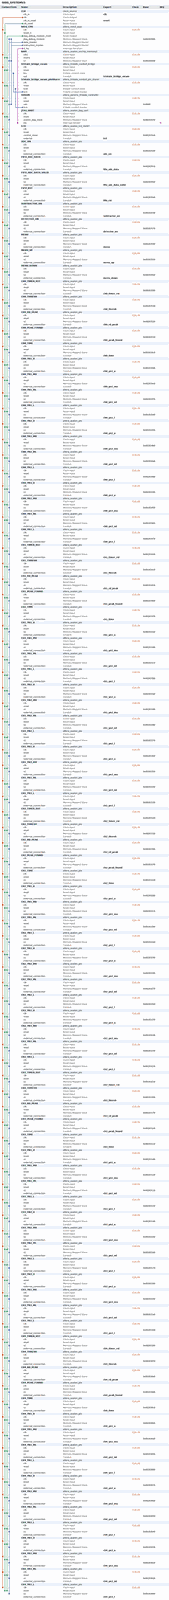
[diagram p0: system contents, whole]
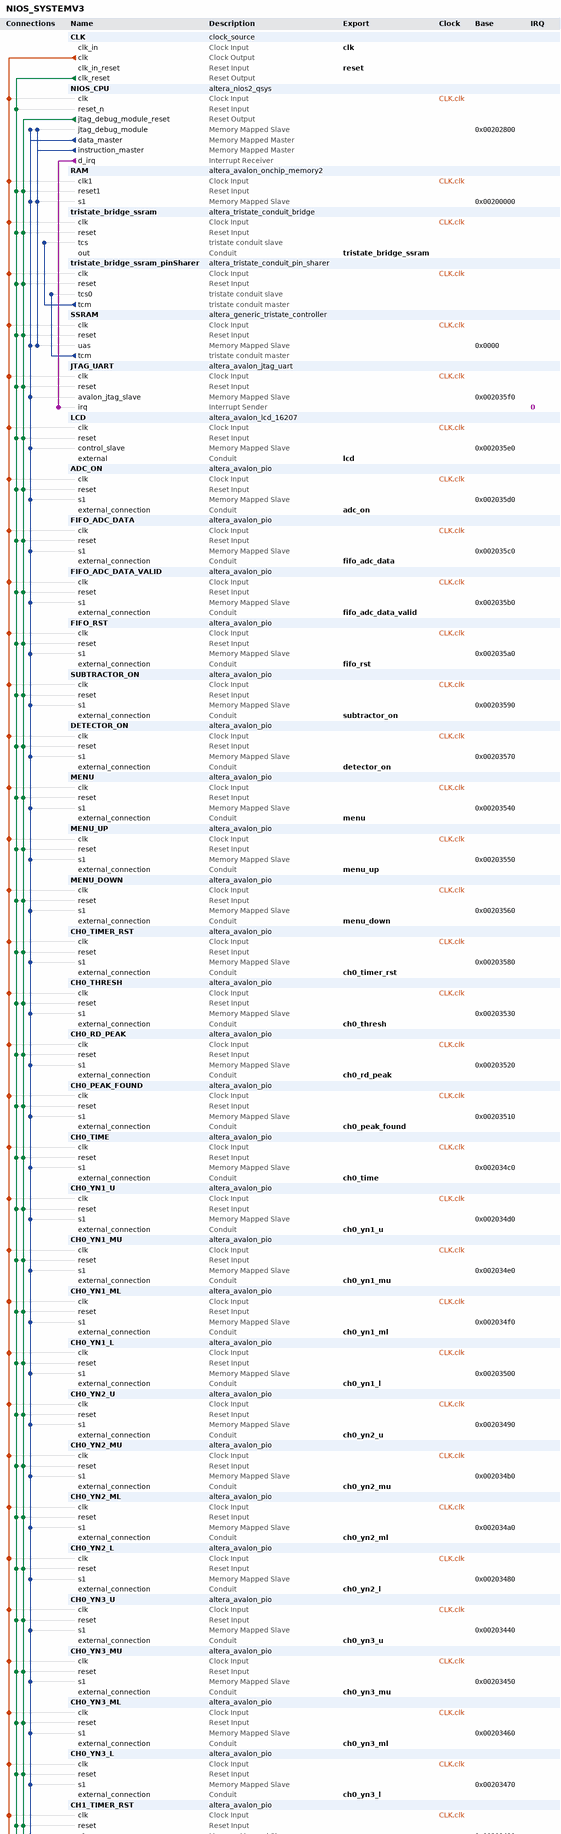
[diagram p1: system contents, upper part]
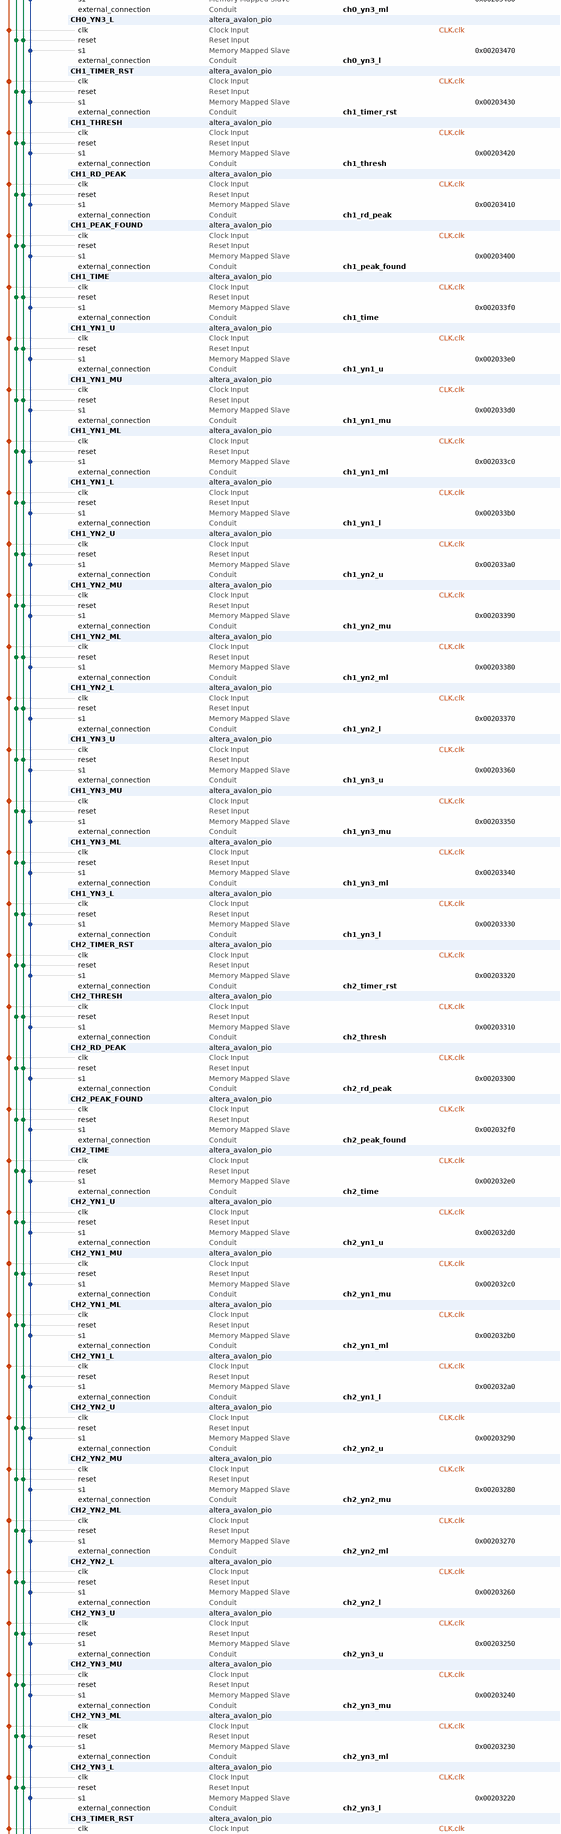
[diagram p2: system contents, middle part]
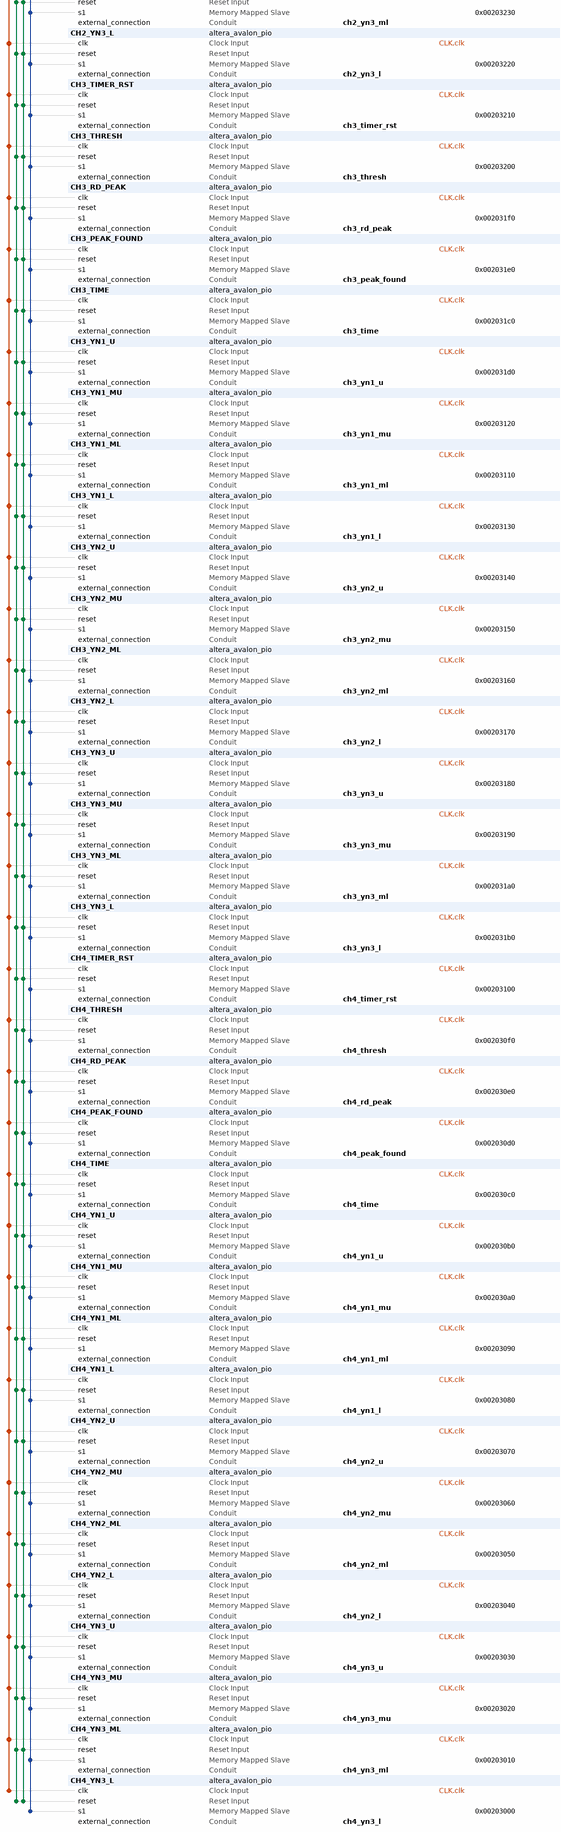
[diagram p3: system contents, lower part]
# Platform Designer (Qsys) system NIOS_SYSTEMV3, Cyclone II EP2C70F896C6
# Parameters at their usual value, and those the tool derives, are not listed.
package require -exact qsys 13.0.1.99.2
create_system NIOS_SYSTEMV3
set_project_property DEVICE_FAMILY {Cyclone II}
set_project_property DEVICE EP2C70F896C6

add_instance CLK clock_source 13.0
set_instance_parameter_value CLK clockFrequency 70000000

add_instance NIOS_CPU altera_nios2_qsys 13.0
set_instance_parameter_value NIOS_CPU muldiv_divider true
set_instance_parameter_value NIOS_CPU resetSlave RAM.s1
set_instance_parameter_value NIOS_CPU mmu_TLBMissExcSlave None
set_instance_parameter_value NIOS_CPU exceptionSlave RAM.s1
set_instance_parameter_value NIOS_CPU breakSlave NIOS_CPU.jtag_debug_module
set_instance_parameter_value NIOS_CPU impl Tiny
set_instance_parameter_value NIOS_CPU icache_size 4096

add_instance RAM altera_avalon_onchip_memory2 13.0.1.99.2
set_instance_parameter_value RAM dataWidth 32
set_instance_parameter_value RAM dualPort false
set_instance_parameter_value RAM initMemContent true
set_instance_parameter_value RAM initializationFileName onchip_mem.hex
set_instance_parameter_value RAM memorySize 8192

add_instance tristate_bridge_ssram altera_tristate_conduit_bridge 13.0

add_instance tristate_bridge_ssram_pinSharer altera_tristate_conduit_pin_sharer 13.0
set_instance_parameter_value tristate_bridge_ssram_pinSharer NUM_INTERFACES 1
set_instance_parameter_value tristate_bridge_ssram_pinSharer MODULE_ORIGIN_LIST SSRAM.tcm,SSRAM.tcm,SSRAM.tcm,SSRAM.tcm,SSRAM.tcm,SSRAM.tcm,SSRAM.tcm,SSRAM.tcm
set_instance_parameter_value tristate_bridge_ssram_pinSharer SIGNAL_ORIGIN_LIST chipselect_n,byteenable_n,outputenable_n,write_n,data,address,reset_n,begintransfer_n
set_instance_parameter_value tristate_bridge_ssram_pinSharer SHARED_SIGNAL_LIST chipenable1_n_to_the_ssram,bw_n_to_the_ssram,outputenable_n_to_the_ssram,bwe_n_to_the_ssram,data_to_and_from_the_ssram,address_to_the_ssram,reset_n_to_the_ssram,adsc_n_to_the_ssram

add_instance SSRAM altera_generic_tristate_controller 13.0
set_instance_parameter_value SSRAM TCM_ADDRESS_W 21
set_instance_parameter_value SSRAM TCM_DATA_W 32
set_instance_parameter_value SSRAM TCM_BYTEENABLE_W 4
set_instance_parameter_value SSRAM TCM_READ_WAIT 0
set_instance_parameter_value SSRAM TCM_WRITE_WAIT 0
set_instance_parameter_value SSRAM TCM_SETUP_WAIT 0
set_instance_parameter_value SSRAM TCM_DATA_HOLD 0
set_instance_parameter_value SSRAM TCM_MAX_PENDING_READ_TRANSACTIONS 5
set_instance_parameter_value SSRAM TCM_TURNAROUND_TIME 2
set_instance_parameter_value SSRAM TCM_TIMING_UNITS 1
set_instance_parameter_value SSRAM TCM_READLATENCY 4
set_instance_parameter_value SSRAM TCM_SYMBOLS_PER_WORD 4
set_instance_parameter_value SSRAM USE_READ 0
set_instance_parameter_value SSRAM USE_BEGINTRANSFER 1
set_instance_parameter_value SSRAM USE_BYTEENABLE 1
set_instance_parameter_value SSRAM USE_OUTPUTENABLE 1
set_instance_parameter_value SSRAM USE_RESET_OUTPUT 1
set_instance_parameter_value SSRAM ACTIVE_LOW_READ 0
set_instance_parameter_value SSRAM ACTIVE_LOW_BYTEENABLE 1
set_instance_parameter_value SSRAM ACTIVE_LOW_OUTPUTENABLE 1
set_instance_parameter_value SSRAM ACTIVE_LOW_BEGINTRANSFER 1
set_instance_parameter_value SSRAM ACTIVE_LOW_RESET_OUTPUT 1
set_instance_parameter_value SSRAM CHIPSELECT_THROUGH_READLATENCY 1
set_instance_parameter_value SSRAM MODULE_ASSIGNMENT_KEYS embeddedsw.configuration.hwClassnameDriverSupportList,embeddedsw.CMacro.SRAM_MEMORY_SIZE,embeddedsw.CMacro.SRAM_MEMORY_UNITS,embeddedsw.CMacro.SSRAM_DATA_WIDTH,embeddedsw.CMacro.SSRAM_READ_LATENCY,embeddedsw.memoryInfo.MEM_INIT_DATA_WIDTH,embeddedsw.memoryInfo.HAS_BYTE_LANE,embeddedsw.memoryInfo.GENERATE_DAT_SYM,embeddedsw.memoryInfo.DAT_SYM_INSTALL_DIR
set_instance_parameter_value SSRAM MODULE_ASSIGNMENT_VALUES altera_avalon_lan91c111:altera_avalon_cfi_flash,2,1048576,32,2,32,1,1,SIM_DIR
set_instance_parameter_value SSRAM INTERFACE_ASSIGNMENT_KEYS embeddedsw.configuration.isMemoryDevice
set_instance_parameter_value SSRAM INTERFACE_ASSIGNMENT_VALUES 1

add_instance JTAG_UART altera_avalon_jtag_uart 13.0.1.99.2
set_instance_parameter_value JTAG_UART simInteractiveOptions NO_INTERACTIVE_WINDOWS

add_instance LCD altera_avalon_lcd_16207 13.0.1.99.2

add_instance ADC_ON altera_avalon_pio 13.0.1.99.2
set_instance_parameter_value ADC_ON direction Output
set_instance_parameter_value ADC_ON width 1

add_instance FIFO_ADC_DATA altera_avalon_pio 13.0.1.99.2
set_instance_parameter_value FIFO_ADC_DATA direction Output
set_instance_parameter_value FIFO_ADC_DATA width 16

add_instance FIFO_ADC_DATA_VALID altera_avalon_pio 13.0.1.99.2
set_instance_parameter_value FIFO_ADC_DATA_VALID direction Output
set_instance_parameter_value FIFO_ADC_DATA_VALID width 1

add_instance FIFO_RST altera_avalon_pio 13.0.1.99.2
set_instance_parameter_value FIFO_RST direction Output
set_instance_parameter_value FIFO_RST width 1

add_instance SUBTRACTOR_ON altera_avalon_pio 13.0.1.99.2
set_instance_parameter_value SUBTRACTOR_ON direction Output
set_instance_parameter_value SUBTRACTOR_ON width 1

add_instance DETECTOR_ON altera_avalon_pio 13.0.1.99.2
set_instance_parameter_value DETECTOR_ON direction Output
set_instance_parameter_value DETECTOR_ON width 1

add_instance MENU altera_avalon_pio 13.0.1.99.2
set_instance_parameter_value MENU captureEdge true
set_instance_parameter_value MENU direction Input
set_instance_parameter_value MENU width 1

add_instance MENU_UP altera_avalon_pio 13.0.1.99.2
set_instance_parameter_value MENU_UP captureEdge true
set_instance_parameter_value MENU_UP direction Input
set_instance_parameter_value MENU_UP width 1

add_instance MENU_DOWN altera_avalon_pio 13.0.1.99.2
set_instance_parameter_value MENU_DOWN direction Input
set_instance_parameter_value MENU_DOWN width 1

add_instance CH0_TIMER_RST altera_avalon_pio 13.0.1.99.2
set_instance_parameter_value CH0_TIMER_RST direction Output
set_instance_parameter_value CH0_TIMER_RST width 1

add_instance CH0_THRESH altera_avalon_pio 13.0.1.99.2
set_instance_parameter_value CH0_THRESH direction Output
set_instance_parameter_value CH0_THRESH width 24

add_instance CH0_RD_PEAK altera_avalon_pio 13.0.1.99.2
set_instance_parameter_value CH0_RD_PEAK direction Output
set_instance_parameter_value CH0_RD_PEAK width 1

add_instance CH0_PEAK_FOUND altera_avalon_pio 13.0.1.99.2
set_instance_parameter_value CH0_PEAK_FOUND captureEdge true
set_instance_parameter_value CH0_PEAK_FOUND direction Input
set_instance_parameter_value CH0_PEAK_FOUND width 1

add_instance CH0_TIME altera_avalon_pio 13.0.1.99.2
set_instance_parameter_value CH0_TIME captureEdge true
set_instance_parameter_value CH0_TIME direction Input
set_instance_parameter_value CH0_TIME width 14

add_instance CH0_YN1_U altera_avalon_pio 13.0.1.99.2
set_instance_parameter_value CH0_YN1_U captureEdge true
set_instance_parameter_value CH0_YN1_U direction Input
set_instance_parameter_value CH0_YN1_U width 14

add_instance CH0_YN1_MU altera_avalon_pio 13.0.1.99.2
set_instance_parameter_value CH0_YN1_MU captureEdge true
set_instance_parameter_value CH0_YN1_MU direction Input
set_instance_parameter_value CH0_YN1_MU width 32

add_instance CH0_YN1_ML altera_avalon_pio 13.0.1.99.2
set_instance_parameter_value CH0_YN1_ML captureEdge true
set_instance_parameter_value CH0_YN1_ML direction Input
set_instance_parameter_value CH0_YN1_ML width 32

add_instance CH0_YN1_L altera_avalon_pio 13.0.1.99.2
set_instance_parameter_value CH0_YN1_L captureEdge true
set_instance_parameter_value CH0_YN1_L direction Input
set_instance_parameter_value CH0_YN1_L width 32

add_instance CH0_YN2_U altera_avalon_pio 13.0.1.99.2
set_instance_parameter_value CH0_YN2_U captureEdge true
set_instance_parameter_value CH0_YN2_U direction Input
set_instance_parameter_value CH0_YN2_U width 14

add_instance CH0_YN2_MU altera_avalon_pio 13.0.1.99.2
set_instance_parameter_value CH0_YN2_MU captureEdge true
set_instance_parameter_value CH0_YN2_MU direction Input
set_instance_parameter_value CH0_YN2_MU width 32

add_instance CH0_YN2_ML altera_avalon_pio 13.0.1.99.2
set_instance_parameter_value CH0_YN2_ML captureEdge true
set_instance_parameter_value CH0_YN2_ML direction Input
set_instance_parameter_value CH0_YN2_ML width 32

add_instance CH0_YN2_L altera_avalon_pio 13.0.1.99.2
set_instance_parameter_value CH0_YN2_L captureEdge true
set_instance_parameter_value CH0_YN2_L direction Input
set_instance_parameter_value CH0_YN2_L width 32

add_instance CH0_YN3_U altera_avalon_pio 13.0.1.99.2
set_instance_parameter_value CH0_YN3_U captureEdge true
set_instance_parameter_value CH0_YN3_U direction Input
set_instance_parameter_value CH0_YN3_U width 14

add_instance CH0_YN3_MU altera_avalon_pio 13.0.1.99.2
set_instance_parameter_value CH0_YN3_MU captureEdge true
set_instance_parameter_value CH0_YN3_MU direction Input
set_instance_parameter_value CH0_YN3_MU width 32

add_instance CH0_YN3_ML altera_avalon_pio 13.0.1.99.2
set_instance_parameter_value CH0_YN3_ML captureEdge true
set_instance_parameter_value CH0_YN3_ML direction Input
set_instance_parameter_value CH0_YN3_ML width 32

add_instance CH0_YN3_L altera_avalon_pio 13.0.1.99.2
set_instance_parameter_value CH0_YN3_L captureEdge true
set_instance_parameter_value CH0_YN3_L direction Input
set_instance_parameter_value CH0_YN3_L width 32

add_instance CH1_TIMER_RST altera_avalon_pio 13.0.1.99.2
set_instance_parameter_value CH1_TIMER_RST direction Output
set_instance_parameter_value CH1_TIMER_RST width 1

add_instance CH1_THRESH altera_avalon_pio 13.0.1.99.2
set_instance_parameter_value CH1_THRESH direction Output
set_instance_parameter_value CH1_THRESH width 24

add_instance CH1_RD_PEAK altera_avalon_pio 13.0.1.99.2
set_instance_parameter_value CH1_RD_PEAK direction Output
set_instance_parameter_value CH1_RD_PEAK width 1

add_instance CH1_PEAK_FOUND altera_avalon_pio 13.0.1.99.2
set_instance_parameter_value CH1_PEAK_FOUND captureEdge true
set_instance_parameter_value CH1_PEAK_FOUND direction Input
set_instance_parameter_value CH1_PEAK_FOUND width 1

add_instance CH1_TIME altera_avalon_pio 13.0.1.99.2
set_instance_parameter_value CH1_TIME captureEdge true
set_instance_parameter_value CH1_TIME direction Input
set_instance_parameter_value CH1_TIME width 14

add_instance CH1_YN1_U altera_avalon_pio 13.0.1.99.2
set_instance_parameter_value CH1_YN1_U captureEdge true
set_instance_parameter_value CH1_YN1_U direction Input
set_instance_parameter_value CH1_YN1_U width 14

add_instance CH1_YN1_MU altera_avalon_pio 13.0.1.99.2
set_instance_parameter_value CH1_YN1_MU captureEdge true
set_instance_parameter_value CH1_YN1_MU direction Input
set_instance_parameter_value CH1_YN1_MU width 32

add_instance CH1_YN1_ML altera_avalon_pio 13.0.1.99.2
set_instance_parameter_value CH1_YN1_ML captureEdge true
set_instance_parameter_value CH1_YN1_ML direction Input
set_instance_parameter_value CH1_YN1_ML width 32

add_instance CH1_YN1_L altera_avalon_pio 13.0.1.99.2
set_instance_parameter_value CH1_YN1_L captureEdge true
set_instance_parameter_value CH1_YN1_L direction Input
set_instance_parameter_value CH1_YN1_L width 32

add_instance CH1_YN2_U altera_avalon_pio 13.0.1.99.2
set_instance_parameter_value CH1_YN2_U captureEdge true
set_instance_parameter_value CH1_YN2_U direction Input
set_instance_parameter_value CH1_YN2_U width 14

add_instance CH1_YN2_MU altera_avalon_pio 13.0.1.99.2
set_instance_parameter_value CH1_YN2_MU captureEdge true
set_instance_parameter_value CH1_YN2_MU direction Input
set_instance_parameter_value CH1_YN2_MU width 32

add_instance CH1_YN2_ML altera_avalon_pio 13.0.1.99.2
set_instance_parameter_value CH1_YN2_ML captureEdge true
set_instance_parameter_value CH1_YN2_ML direction Input
set_instance_parameter_value CH1_YN2_ML width 32

add_instance CH1_YN2_L altera_avalon_pio 13.0.1.99.2
set_instance_parameter_value CH1_YN2_L captureEdge true
set_instance_parameter_value CH1_YN2_L direction Input
set_instance_parameter_value CH1_YN2_L width 32

add_instance CH1_YN3_U altera_avalon_pio 13.0.1.99.2
set_instance_parameter_value CH1_YN3_U captureEdge true
set_instance_parameter_value CH1_YN3_U direction Input
set_instance_parameter_value CH1_YN3_U width 14

add_instance CH1_YN3_MU altera_avalon_pio 13.0.1.99.2
set_instance_parameter_value CH1_YN3_MU captureEdge true
set_instance_parameter_value CH1_YN3_MU direction Input
set_instance_parameter_value CH1_YN3_MU width 32

add_instance CH1_YN3_ML altera_avalon_pio 13.0.1.99.2
set_instance_parameter_value CH1_YN3_ML captureEdge true
set_instance_parameter_value CH1_YN3_ML direction Input
set_instance_parameter_value CH1_YN3_ML width 32

add_instance CH1_YN3_L altera_avalon_pio 13.0.1.99.2
set_instance_parameter_value CH1_YN3_L captureEdge true
set_instance_parameter_value CH1_YN3_L direction Input
set_instance_parameter_value CH1_YN3_L width 32

add_instance CH2_TIMER_RST altera_avalon_pio 13.0.1.99.2
set_instance_parameter_value CH2_TIMER_RST direction Output
set_instance_parameter_value CH2_TIMER_RST width 1

add_instance CH2_THRESH altera_avalon_pio 13.0.1.99.2
set_instance_parameter_value CH2_THRESH direction Output
set_instance_parameter_value CH2_THRESH width 24

add_instance CH2_RD_PEAK altera_avalon_pio 13.0.1.99.2
set_instance_parameter_value CH2_RD_PEAK direction Output
set_instance_parameter_value CH2_RD_PEAK width 1

add_instance CH2_PEAK_FOUND altera_avalon_pio 13.0.1.99.2
set_instance_parameter_value CH2_PEAK_FOUND captureEdge true
set_instance_parameter_value CH2_PEAK_FOUND direction Input
set_instance_parameter_value CH2_PEAK_FOUND width 1

add_instance CH2_TIME altera_avalon_pio 13.0.1.99.2
set_instance_parameter_value CH2_TIME captureEdge true
set_instance_parameter_value CH2_TIME direction Input
set_instance_parameter_value CH2_TIME width 14

add_instance CH2_YN1_U altera_avalon_pio 13.0.1.99.2
set_instance_parameter_value CH2_YN1_U captureEdge true
set_instance_parameter_value CH2_YN1_U direction Input
set_instance_parameter_value CH2_YN1_U width 14

add_instance CH2_YN1_MU altera_avalon_pio 13.0.1.99.2
set_instance_parameter_value CH2_YN1_MU captureEdge true
set_instance_parameter_value CH2_YN1_MU direction Input
set_instance_parameter_value CH2_YN1_MU width 32

add_instance CH2_YN1_ML altera_avalon_pio 13.0.1.99.2
set_instance_parameter_value CH2_YN1_ML captureEdge true
set_instance_parameter_value CH2_YN1_ML direction Input
set_instance_parameter_value CH2_YN1_ML width 32

add_instance CH2_YN1_L altera_avalon_pio 13.0.1.99.2
set_instance_parameter_value CH2_YN1_L captureEdge true
set_instance_parameter_value CH2_YN1_L direction Input
set_instance_parameter_value CH2_YN1_L width 32

add_instance CH2_YN2_U altera_avalon_pio 13.0.1.99.2
set_instance_parameter_value CH2_YN2_U captureEdge true
set_instance_parameter_value CH2_YN2_U direction Input
set_instance_parameter_value CH2_YN2_U width 14

add_instance CH2_YN2_MU altera_avalon_pio 13.0.1.99.2
set_instance_parameter_value CH2_YN2_MU captureEdge true
set_instance_parameter_value CH2_YN2_MU direction Input
set_instance_parameter_value CH2_YN2_MU width 32

add_instance CH2_YN2_ML altera_avalon_pio 13.0.1.99.2
set_instance_parameter_value CH2_YN2_ML captureEdge true
set_instance_parameter_value CH2_YN2_ML direction Input
set_instance_parameter_value CH2_YN2_ML width 32

add_instance CH2_YN2_L altera_avalon_pio 13.0.1.99.2
set_instance_parameter_value CH2_YN2_L captureEdge true
set_instance_parameter_value CH2_YN2_L direction Input
set_instance_parameter_value CH2_YN2_L width 32

add_instance CH2_YN3_U altera_avalon_pio 13.0.1.99.2
set_instance_parameter_value CH2_YN3_U captureEdge true
set_instance_parameter_value CH2_YN3_U direction Input
set_instance_parameter_value CH2_YN3_U width 14

add_instance CH2_YN3_MU altera_avalon_pio 13.0.1.99.2
set_instance_parameter_value CH2_YN3_MU captureEdge true
set_instance_parameter_value CH2_YN3_MU direction Input
set_instance_parameter_value CH2_YN3_MU width 32

add_instance CH2_YN3_ML altera_avalon_pio 13.0.1.99.2
set_instance_parameter_value CH2_YN3_ML captureEdge true
set_instance_parameter_value CH2_YN3_ML direction Input
set_instance_parameter_value CH2_YN3_ML width 32

add_instance CH2_YN3_L altera_avalon_pio 13.0.1.99.2
set_instance_parameter_value CH2_YN3_L captureEdge true
set_instance_parameter_value CH2_YN3_L direction Input
set_instance_parameter_value CH2_YN3_L width 32

add_instance CH3_TIMER_RST altera_avalon_pio 13.0.1.99.2
set_instance_parameter_value CH3_TIMER_RST direction Output
set_instance_parameter_value CH3_TIMER_RST width 1

add_instance CH3_THRESH altera_avalon_pio 13.0.1.99.2
set_instance_parameter_value CH3_THRESH direction Output
set_instance_parameter_value CH3_THRESH width 24

add_instance CH3_RD_PEAK altera_avalon_pio 13.0.1.99.2
set_instance_parameter_value CH3_RD_PEAK direction Output
set_instance_parameter_value CH3_RD_PEAK width 1

add_instance CH3_PEAK_FOUND altera_avalon_pio 13.0.1.99.2
set_instance_parameter_value CH3_PEAK_FOUND captureEdge true
set_instance_parameter_value CH3_PEAK_FOUND direction Input
set_instance_parameter_value CH3_PEAK_FOUND width 1

add_instance CH3_TIME altera_avalon_pio 13.0.1.99.2
set_instance_parameter_value CH3_TIME captureEdge true
set_instance_parameter_value CH3_TIME direction Input
set_instance_parameter_value CH3_TIME width 14

add_instance CH3_YN1_U altera_avalon_pio 13.0.1.99.2
set_instance_parameter_value CH3_YN1_U captureEdge true
set_instance_parameter_value CH3_YN1_U direction Input
set_instance_parameter_value CH3_YN1_U width 14

add_instance CH3_YN1_MU altera_avalon_pio 13.0.1.99.2
set_instance_parameter_value CH3_YN1_MU captureEdge true
set_instance_parameter_value CH3_YN1_MU direction Input
set_instance_parameter_value CH3_YN1_MU width 32

add_instance CH3_YN1_ML altera_avalon_pio 13.0.1.99.2
set_instance_parameter_value CH3_YN1_ML captureEdge true
set_instance_parameter_value CH3_YN1_ML direction Input
set_instance_parameter_value CH3_YN1_ML width 32

add_instance CH3_YN1_L altera_avalon_pio 13.0.1.99.2
set_instance_parameter_value CH3_YN1_L captureEdge true
set_instance_parameter_value CH3_YN1_L direction Input
set_instance_parameter_value CH3_YN1_L width 32

add_instance CH3_YN2_U altera_avalon_pio 13.0.1.99.2
set_instance_parameter_value CH3_YN2_U captureEdge true
set_instance_parameter_value CH3_YN2_U direction Input
set_instance_parameter_value CH3_YN2_U width 14

add_instance CH3_YN2_MU altera_avalon_pio 13.0.1.99.2
set_instance_parameter_value CH3_YN2_MU captureEdge true
set_instance_parameter_value CH3_YN2_MU direction Input
set_instance_parameter_value CH3_YN2_MU width 32

add_instance CH3_YN2_ML altera_avalon_pio 13.0.1.99.2
set_instance_parameter_value CH3_YN2_ML captureEdge true
set_instance_parameter_value CH3_YN2_ML direction Input
set_instance_parameter_value CH3_YN2_ML width 32

add_instance CH3_YN2_L altera_avalon_pio 13.0.1.99.2
set_instance_parameter_value CH3_YN2_L captureEdge true
set_instance_parameter_value CH3_YN2_L direction Input
set_instance_parameter_value CH3_YN2_L width 32

add_instance CH3_YN3_U altera_avalon_pio 13.0.1.99.2
set_instance_parameter_value CH3_YN3_U captureEdge true
set_instance_parameter_value CH3_YN3_U direction Input
set_instance_parameter_value CH3_YN3_U width 14

add_instance CH3_YN3_MU altera_avalon_pio 13.0.1.99.2
set_instance_parameter_value CH3_YN3_MU captureEdge true
set_instance_parameter_value CH3_YN3_MU direction Input
set_instance_parameter_value CH3_YN3_MU width 32

add_instance CH3_YN3_ML altera_avalon_pio 13.0.1.99.2
set_instance_parameter_value CH3_YN3_ML captureEdge true
set_instance_parameter_value CH3_YN3_ML direction Input
set_instance_parameter_value CH3_YN3_ML width 32

add_instance CH3_YN3_L altera_avalon_pio 13.0.1.99.2
set_instance_parameter_value CH3_YN3_L captureEdge true
set_instance_parameter_value CH3_YN3_L direction Input
set_instance_parameter_value CH3_YN3_L width 32

add_instance CH4_TIMER_RST altera_avalon_pio 13.0.1.99.2
set_instance_parameter_value CH4_TIMER_RST direction Output
set_instance_parameter_value CH4_TIMER_RST width 1

add_instance CH4_THRESH altera_avalon_pio 13.0.1.99.2
set_instance_parameter_value CH4_THRESH direction Output
set_instance_parameter_value CH4_THRESH width 24

add_instance CH4_RD_PEAK altera_avalon_pio 13.0.1.99.2
set_instance_parameter_value CH4_RD_PEAK direction Output
set_instance_parameter_value CH4_RD_PEAK width 1

add_instance CH4_PEAK_FOUND altera_avalon_pio 13.0.1.99.2
set_instance_parameter_value CH4_PEAK_FOUND captureEdge true
set_instance_parameter_value CH4_PEAK_FOUND direction Input
set_instance_parameter_value CH4_PEAK_FOUND width 1

add_instance CH4_TIME altera_avalon_pio 13.0.1.99.2
set_instance_parameter_value CH4_TIME captureEdge true
set_instance_parameter_value CH4_TIME direction Input
set_instance_parameter_value CH4_TIME width 14

add_instance CH4_YN1_U altera_avalon_pio 13.0.1.99.2
set_instance_parameter_value CH4_YN1_U captureEdge true
set_instance_parameter_value CH4_YN1_U direction Input
set_instance_parameter_value CH4_YN1_U width 14

add_instance CH4_YN1_MU altera_avalon_pio 13.0.1.99.2
set_instance_parameter_value CH4_YN1_MU captureEdge true
set_instance_parameter_value CH4_YN1_MU direction Input
set_instance_parameter_value CH4_YN1_MU width 32

add_instance CH4_YN1_ML altera_avalon_pio 13.0.1.99.2
set_instance_parameter_value CH4_YN1_ML captureEdge true
set_instance_parameter_value CH4_YN1_ML direction Input
set_instance_parameter_value CH4_YN1_ML width 32

add_instance CH4_YN1_L altera_avalon_pio 13.0.1.99.2
set_instance_parameter_value CH4_YN1_L captureEdge true
set_instance_parameter_value CH4_YN1_L direction Input
set_instance_parameter_value CH4_YN1_L width 32

add_instance CH4_YN2_U altera_avalon_pio 13.0.1.99.2
set_instance_parameter_value CH4_YN2_U captureEdge true
set_instance_parameter_value CH4_YN2_U direction Input
set_instance_parameter_value CH4_YN2_U width 14

add_instance CH4_YN2_MU altera_avalon_pio 13.0.1.99.2
set_instance_parameter_value CH4_YN2_MU captureEdge true
set_instance_parameter_value CH4_YN2_MU direction Input
set_instance_parameter_value CH4_YN2_MU width 32

add_instance CH4_YN2_ML altera_avalon_pio 13.0.1.99.2
set_instance_parameter_value CH4_YN2_ML captureEdge true
set_instance_parameter_value CH4_YN2_ML direction Input
set_instance_parameter_value CH4_YN2_ML width 32

add_instance CH4_YN2_L altera_avalon_pio 13.0.1.99.2
set_instance_parameter_value CH4_YN2_L captureEdge true
set_instance_parameter_value CH4_YN2_L direction Input
set_instance_parameter_value CH4_YN2_L width 32

add_instance CH4_YN3_U altera_avalon_pio 13.0.1.99.2
set_instance_parameter_value CH4_YN3_U captureEdge true
set_instance_parameter_value CH4_YN3_U direction Input
set_instance_parameter_value CH4_YN3_U width 14

add_instance CH4_YN3_MU altera_avalon_pio 13.0.1.99.2
set_instance_parameter_value CH4_YN3_MU captureEdge true
set_instance_parameter_value CH4_YN3_MU direction Input
set_instance_parameter_value CH4_YN3_MU width 32

add_instance CH4_YN3_ML altera_avalon_pio 13.0.1.99.2
set_instance_parameter_value CH4_YN3_ML captureEdge true
set_instance_parameter_value CH4_YN3_ML direction Input
set_instance_parameter_value CH4_YN3_ML width 32

add_instance CH4_YN3_L altera_avalon_pio 13.0.1.99.2
set_instance_parameter_value CH4_YN3_L captureEdge true
set_instance_parameter_value CH4_YN3_L direction Input
set_instance_parameter_value CH4_YN3_L width 32

# connections
add_connection CLK.clk ADC_ON.clk clock
add_connection CLK.clk CH0_PEAK_FOUND.clk clock
add_connection CLK.clk CH0_RD_PEAK.clk clock
add_connection CLK.clk CH0_THRESH.clk clock
add_connection CLK.clk CH0_TIME.clk clock
add_connection CLK.clk CH0_TIMER_RST.clk clock
add_connection CLK.clk CH0_YN1_L.clk clock
add_connection CLK.clk CH0_YN1_ML.clk clock
add_connection CLK.clk CH0_YN1_MU.clk clock
add_connection CLK.clk CH0_YN1_U.clk clock
add_connection CLK.clk CH0_YN2_L.clk clock
add_connection CLK.clk CH0_YN2_ML.clk clock
add_connection CLK.clk CH0_YN2_MU.clk clock
add_connection CLK.clk CH0_YN2_U.clk clock
add_connection CLK.clk CH0_YN3_L.clk clock
add_connection CLK.clk CH0_YN3_ML.clk clock
add_connection CLK.clk CH0_YN3_MU.clk clock
add_connection CLK.clk CH0_YN3_U.clk clock
add_connection CLK.clk CH1_PEAK_FOUND.clk clock
add_connection CLK.clk CH1_RD_PEAK.clk clock
add_connection CLK.clk CH1_THRESH.clk clock
add_connection CLK.clk CH1_TIME.clk clock
add_connection CLK.clk CH1_TIMER_RST.clk clock
add_connection CLK.clk CH1_YN1_L.clk clock
add_connection CLK.clk CH1_YN1_ML.clk clock
add_connection CLK.clk CH1_YN1_MU.clk clock
add_connection CLK.clk CH1_YN1_U.clk clock
add_connection CLK.clk CH1_YN2_L.clk clock
add_connection CLK.clk CH1_YN2_ML.clk clock
add_connection CLK.clk CH1_YN2_MU.clk clock
add_connection CLK.clk CH1_YN2_U.clk clock
add_connection CLK.clk CH1_YN3_L.clk clock
add_connection CLK.clk CH1_YN3_ML.clk clock
add_connection CLK.clk CH1_YN3_MU.clk clock
add_connection CLK.clk CH1_YN3_U.clk clock
add_connection CLK.clk CH2_PEAK_FOUND.clk clock
add_connection CLK.clk CH2_RD_PEAK.clk clock
add_connection CLK.clk CH2_THRESH.clk clock
add_connection CLK.clk CH2_TIME.clk clock
add_connection CLK.clk CH2_TIMER_RST.clk clock
add_connection CLK.clk CH2_YN1_L.clk clock
add_connection CLK.clk CH2_YN1_ML.clk clock
add_connection CLK.clk CH2_YN1_MU.clk clock
add_connection CLK.clk CH2_YN1_U.clk clock
add_connection CLK.clk CH2_YN2_L.clk clock
add_connection CLK.clk CH2_YN2_ML.clk clock
add_connection CLK.clk CH2_YN2_MU.clk clock
add_connection CLK.clk CH2_YN2_U.clk clock
add_connection CLK.clk CH2_YN3_L.clk clock
add_connection CLK.clk CH2_YN3_ML.clk clock
add_connection CLK.clk CH2_YN3_MU.clk clock
add_connection CLK.clk CH2_YN3_U.clk clock
add_connection CLK.clk CH3_PEAK_FOUND.clk clock
add_connection CLK.clk CH3_RD_PEAK.clk clock
add_connection CLK.clk CH3_THRESH.clk clock
add_connection CLK.clk CH3_TIME.clk clock
add_connection CLK.clk CH3_TIMER_RST.clk clock
add_connection CLK.clk CH3_YN1_L.clk clock
add_connection CLK.clk CH3_YN1_ML.clk clock
add_connection CLK.clk CH3_YN1_MU.clk clock
add_connection CLK.clk CH3_YN1_U.clk clock
add_connection CLK.clk CH3_YN2_L.clk clock
add_connection CLK.clk CH3_YN2_ML.clk clock
add_connection CLK.clk CH3_YN2_MU.clk clock
add_connection CLK.clk CH3_YN2_U.clk clock
add_connection CLK.clk CH3_YN3_L.clk clock
add_connection CLK.clk CH3_YN3_ML.clk clock
add_connection CLK.clk CH3_YN3_MU.clk clock
add_connection CLK.clk CH3_YN3_U.clk clock
add_connection CLK.clk CH4_PEAK_FOUND.clk clock
add_connection CLK.clk CH4_RD_PEAK.clk clock
add_connection CLK.clk CH4_THRESH.clk clock
add_connection CLK.clk CH4_TIME.clk clock
add_connection CLK.clk CH4_TIMER_RST.clk clock
add_connection CLK.clk CH4_YN1_L.clk clock
add_connection CLK.clk CH4_YN1_ML.clk clock
add_connection CLK.clk CH4_YN1_MU.clk clock
add_connection CLK.clk CH4_YN1_U.clk clock
add_connection CLK.clk CH4_YN2_L.clk clock
add_connection CLK.clk CH4_YN2_ML.clk clock
add_connection CLK.clk CH4_YN2_MU.clk clock
add_connection CLK.clk CH4_YN2_U.clk clock
add_connection CLK.clk CH4_YN3_L.clk clock
add_connection CLK.clk CH4_YN3_ML.clk clock
add_connection CLK.clk CH4_YN3_MU.clk clock
add_connection CLK.clk CH4_YN3_U.clk clock
add_connection CLK.clk DETECTOR_ON.clk clock
add_connection CLK.clk FIFO_ADC_DATA.clk clock
add_connection CLK.clk FIFO_ADC_DATA_VALID.clk clock
add_connection CLK.clk FIFO_RST.clk clock
add_connection CLK.clk JTAG_UART.clk clock
add_connection CLK.clk LCD.clk clock
add_connection CLK.clk MENU.clk clock
add_connection CLK.clk MENU_DOWN.clk clock
add_connection CLK.clk MENU_UP.clk clock
add_connection CLK.clk NIOS_CPU.clk clock
add_connection CLK.clk RAM.clk1 clock
add_connection CLK.clk SSRAM.clk clock
add_connection CLK.clk SUBTRACTOR_ON.clk clock
add_connection CLK.clk tristate_bridge_ssram.clk clock
add_connection CLK.clk tristate_bridge_ssram_pinSharer.clk clock
add_connection CLK.clk_reset ADC_ON.reset reset
add_connection CLK.clk_reset CH0_PEAK_FOUND.reset reset
add_connection CLK.clk_reset CH0_RD_PEAK.reset reset
add_connection CLK.clk_reset CH0_THRESH.reset reset
add_connection CLK.clk_reset CH0_TIME.reset reset
add_connection CLK.clk_reset CH0_TIMER_RST.reset reset
add_connection CLK.clk_reset CH0_YN1_L.reset reset
add_connection CLK.clk_reset CH0_YN1_ML.reset reset
add_connection CLK.clk_reset CH0_YN1_MU.reset reset
add_connection CLK.clk_reset CH0_YN1_U.reset reset
add_connection CLK.clk_reset CH0_YN2_L.reset reset
add_connection CLK.clk_reset CH0_YN2_ML.reset reset
add_connection CLK.clk_reset CH0_YN2_MU.reset reset
add_connection CLK.clk_reset CH0_YN2_U.reset reset
add_connection CLK.clk_reset CH0_YN3_L.reset reset
add_connection CLK.clk_reset CH0_YN3_ML.reset reset
add_connection CLK.clk_reset CH0_YN3_MU.reset reset
add_connection CLK.clk_reset CH0_YN3_U.reset reset
add_connection CLK.clk_reset CH1_PEAK_FOUND.reset reset
add_connection CLK.clk_reset CH1_RD_PEAK.reset reset
add_connection CLK.clk_reset CH1_THRESH.reset reset
add_connection CLK.clk_reset CH1_TIME.reset reset
add_connection CLK.clk_reset CH1_TIMER_RST.reset reset
add_connection CLK.clk_reset CH1_YN1_L.reset reset
add_connection CLK.clk_reset CH1_YN1_ML.reset reset
add_connection CLK.clk_reset CH1_YN1_MU.reset reset
add_connection CLK.clk_reset CH1_YN1_U.reset reset
add_connection CLK.clk_reset CH1_YN2_L.reset reset
add_connection CLK.clk_reset CH1_YN2_ML.reset reset
add_connection CLK.clk_reset CH1_YN2_MU.reset reset
add_connection CLK.clk_reset CH1_YN2_U.reset reset
add_connection CLK.clk_reset CH1_YN3_L.reset reset
add_connection CLK.clk_reset CH1_YN3_ML.reset reset
add_connection CLK.clk_reset CH1_YN3_MU.reset reset
add_connection CLK.clk_reset CH1_YN3_U.reset reset
add_connection CLK.clk_reset CH2_PEAK_FOUND.reset reset
add_connection CLK.clk_reset CH2_RD_PEAK.reset reset
add_connection CLK.clk_reset CH2_THRESH.reset reset
add_connection CLK.clk_reset CH2_TIME.reset reset
add_connection CLK.clk_reset CH2_TIMER_RST.reset reset
add_connection CLK.clk_reset CH2_YN1_ML.reset reset
add_connection CLK.clk_reset CH2_YN1_MU.reset reset
add_connection CLK.clk_reset CH2_YN1_U.reset reset
add_connection CLK.clk_reset CH2_YN2_L.reset reset
add_connection CLK.clk_reset CH2_YN2_ML.reset reset
add_connection CLK.clk_reset CH2_YN2_MU.reset reset
add_connection CLK.clk_reset CH2_YN2_U.reset reset
add_connection CLK.clk_reset CH2_YN3_L.reset reset
add_connection CLK.clk_reset CH2_YN3_ML.reset reset
add_connection CLK.clk_reset CH2_YN3_MU.reset reset
add_connection CLK.clk_reset CH2_YN3_U.reset reset
add_connection CLK.clk_reset CH3_PEAK_FOUND.reset reset
add_connection CLK.clk_reset CH3_RD_PEAK.reset reset
add_connection CLK.clk_reset CH3_THRESH.reset reset
add_connection CLK.clk_reset CH3_TIME.reset reset
add_connection CLK.clk_reset CH3_TIMER_RST.reset reset
add_connection CLK.clk_reset CH3_YN1_L.reset reset
add_connection CLK.clk_reset CH3_YN1_ML.reset reset
add_connection CLK.clk_reset CH3_YN1_MU.reset reset
add_connection CLK.clk_reset CH3_YN1_U.reset reset
add_connection CLK.clk_reset CH3_YN2_L.reset reset
add_connection CLK.clk_reset CH3_YN2_ML.reset reset
add_connection CLK.clk_reset CH3_YN2_MU.reset reset
add_connection CLK.clk_reset CH3_YN2_U.reset reset
add_connection CLK.clk_reset CH3_YN3_L.reset reset
add_connection CLK.clk_reset CH3_YN3_ML.reset reset
add_connection CLK.clk_reset CH3_YN3_MU.reset reset
add_connection CLK.clk_reset CH3_YN3_U.reset reset
add_connection CLK.clk_reset CH4_PEAK_FOUND.reset reset
add_connection CLK.clk_reset CH4_RD_PEAK.reset reset
add_connection CLK.clk_reset CH4_THRESH.reset reset
add_connection CLK.clk_reset CH4_TIME.reset reset
add_connection CLK.clk_reset CH4_TIMER_RST.reset reset
add_connection CLK.clk_reset CH4_YN1_L.reset reset
add_connection CLK.clk_reset CH4_YN1_ML.reset reset
add_connection CLK.clk_reset CH4_YN1_MU.reset reset
add_connection CLK.clk_reset CH4_YN1_U.reset reset
add_connection CLK.clk_reset CH4_YN2_L.reset reset
add_connection CLK.clk_reset CH4_YN2_ML.reset reset
add_connection CLK.clk_reset CH4_YN2_MU.reset reset
add_connection CLK.clk_reset CH4_YN2_U.reset reset
add_connection CLK.clk_reset CH4_YN3_L.reset reset
add_connection CLK.clk_reset CH4_YN3_ML.reset reset
add_connection CLK.clk_reset CH4_YN3_MU.reset reset
add_connection CLK.clk_reset CH4_YN3_U.reset reset
add_connection CLK.clk_reset DETECTOR_ON.reset reset
add_connection CLK.clk_reset FIFO_ADC_DATA.reset reset
add_connection CLK.clk_reset FIFO_ADC_DATA_VALID.reset reset
add_connection CLK.clk_reset FIFO_RST.reset reset
add_connection CLK.clk_reset JTAG_UART.reset reset
add_connection CLK.clk_reset LCD.reset reset
add_connection CLK.clk_reset MENU.reset reset
add_connection CLK.clk_reset MENU_DOWN.reset reset
add_connection CLK.clk_reset MENU_UP.reset reset
add_connection CLK.clk_reset NIOS_CPU.reset_n reset
add_connection CLK.clk_reset RAM.reset1 reset
add_connection CLK.clk_reset SSRAM.reset reset
add_connection CLK.clk_reset SUBTRACTOR_ON.reset reset
add_connection CLK.clk_reset tristate_bridge_ssram.reset reset
add_connection CLK.clk_reset tristate_bridge_ssram_pinSharer.reset reset
add_connection NIOS_CPU.jtag_debug_module_reset ADC_ON.reset reset
add_connection NIOS_CPU.jtag_debug_module_reset CH0_PEAK_FOUND.reset reset
add_connection NIOS_CPU.jtag_debug_module_reset CH0_RD_PEAK.reset reset
add_connection NIOS_CPU.jtag_debug_module_reset CH0_THRESH.reset reset
add_connection NIOS_CPU.jtag_debug_module_reset CH0_TIME.reset reset
add_connection NIOS_CPU.jtag_debug_module_reset CH0_TIMER_RST.reset reset
add_connection NIOS_CPU.jtag_debug_module_reset CH0_YN1_L.reset reset
add_connection NIOS_CPU.jtag_debug_module_reset CH0_YN1_ML.reset reset
add_connection NIOS_CPU.jtag_debug_module_reset CH0_YN1_MU.reset reset
add_connection NIOS_CPU.jtag_debug_module_reset CH0_YN1_U.reset reset
add_connection NIOS_CPU.jtag_debug_module_reset CH0_YN2_L.reset reset
add_connection NIOS_CPU.jtag_debug_module_reset CH0_YN2_ML.reset reset
add_connection NIOS_CPU.jtag_debug_module_reset CH0_YN2_MU.reset reset
add_connection NIOS_CPU.jtag_debug_module_reset CH0_YN2_U.reset reset
add_connection NIOS_CPU.jtag_debug_module_reset CH0_YN3_L.reset reset
add_connection NIOS_CPU.jtag_debug_module_reset CH0_YN3_ML.reset reset
add_connection NIOS_CPU.jtag_debug_module_reset CH0_YN3_MU.reset reset
add_connection NIOS_CPU.jtag_debug_module_reset CH0_YN3_U.reset reset
add_connection NIOS_CPU.jtag_debug_module_reset CH1_PEAK_FOUND.reset reset
add_connection NIOS_CPU.jtag_debug_module_reset CH1_RD_PEAK.reset reset
add_connection NIOS_CPU.jtag_debug_module_reset CH1_THRESH.reset reset
add_connection NIOS_CPU.jtag_debug_module_reset CH1_TIME.reset reset
add_connection NIOS_CPU.jtag_debug_module_reset CH1_TIMER_RST.reset reset
add_connection NIOS_CPU.jtag_debug_module_reset CH1_YN1_L.reset reset
add_connection NIOS_CPU.jtag_debug_module_reset CH1_YN1_ML.reset reset
add_connection NIOS_CPU.jtag_debug_module_reset CH1_YN1_MU.reset reset
add_connection NIOS_CPU.jtag_debug_module_reset CH1_YN1_U.reset reset
add_connection NIOS_CPU.jtag_debug_module_reset CH1_YN2_L.reset reset
add_connection NIOS_CPU.jtag_debug_module_reset CH1_YN2_ML.reset reset
add_connection NIOS_CPU.jtag_debug_module_reset CH1_YN2_MU.reset reset
add_connection NIOS_CPU.jtag_debug_module_reset CH1_YN2_U.reset reset
add_connection NIOS_CPU.jtag_debug_module_reset CH1_YN3_L.reset reset
add_connection NIOS_CPU.jtag_debug_module_reset CH1_YN3_ML.reset reset
add_connection NIOS_CPU.jtag_debug_module_reset CH1_YN3_MU.reset reset
add_connection NIOS_CPU.jtag_debug_module_reset CH1_YN3_U.reset reset
add_connection NIOS_CPU.jtag_debug_module_reset CH2_PEAK_FOUND.reset reset
add_connection NIOS_CPU.jtag_debug_module_reset CH2_RD_PEAK.reset reset
add_connection NIOS_CPU.jtag_debug_module_reset CH2_THRESH.reset reset
add_connection NIOS_CPU.jtag_debug_module_reset CH2_TIME.reset reset
add_connection NIOS_CPU.jtag_debug_module_reset CH2_TIMER_RST.reset reset
add_connection NIOS_CPU.jtag_debug_module_reset CH2_YN1_L.reset reset
add_connection NIOS_CPU.jtag_debug_module_reset CH2_YN1_ML.reset reset
add_connection NIOS_CPU.jtag_debug_module_reset CH2_YN1_MU.reset reset
add_connection NIOS_CPU.jtag_debug_module_reset CH2_YN1_U.reset reset
add_connection NIOS_CPU.jtag_debug_module_reset CH2_YN2_L.reset reset
add_connection NIOS_CPU.jtag_debug_module_reset CH2_YN2_ML.reset reset
add_connection NIOS_CPU.jtag_debug_module_reset CH2_YN2_MU.reset reset
add_connection NIOS_CPU.jtag_debug_module_reset CH2_YN2_U.reset reset
add_connection NIOS_CPU.jtag_debug_module_reset CH2_YN3_L.reset reset
add_connection NIOS_CPU.jtag_debug_module_reset CH2_YN3_ML.reset reset
add_connection NIOS_CPU.jtag_debug_module_reset CH2_YN3_MU.reset reset
add_connection NIOS_CPU.jtag_debug_module_reset CH2_YN3_U.reset reset
add_connection NIOS_CPU.jtag_debug_module_reset CH3_PEAK_FOUND.reset reset
add_connection NIOS_CPU.jtag_debug_module_reset CH3_RD_PEAK.reset reset
add_connection NIOS_CPU.jtag_debug_module_reset CH3_THRESH.reset reset
add_connection NIOS_CPU.jtag_debug_module_reset CH3_TIME.reset reset
add_connection NIOS_CPU.jtag_debug_module_reset CH3_TIMER_RST.reset reset
add_connection NIOS_CPU.jtag_debug_module_reset CH3_YN1_L.reset reset
add_connection NIOS_CPU.jtag_debug_module_reset CH3_YN1_ML.reset reset
add_connection NIOS_CPU.jtag_debug_module_reset CH3_YN1_MU.reset reset
add_connection NIOS_CPU.jtag_debug_module_reset CH3_YN1_U.reset reset
add_connection NIOS_CPU.jtag_debug_module_reset CH3_YN2_L.reset reset
add_connection NIOS_CPU.jtag_debug_module_reset CH3_YN2_ML.reset reset
add_connection NIOS_CPU.jtag_debug_module_reset CH3_YN2_MU.reset reset
add_connection NIOS_CPU.jtag_debug_module_reset CH3_YN2_U.reset reset
add_connection NIOS_CPU.jtag_debug_module_reset CH3_YN3_L.reset reset
add_connection NIOS_CPU.jtag_debug_module_reset CH3_YN3_ML.reset reset
add_connection NIOS_CPU.jtag_debug_module_reset CH3_YN3_MU.reset reset
add_connection NIOS_CPU.jtag_debug_module_reset CH3_YN3_U.reset reset
add_connection NIOS_CPU.jtag_debug_module_reset CH4_PEAK_FOUND.reset reset
add_connection NIOS_CPU.jtag_debug_module_reset CH4_RD_PEAK.reset reset
add_connection NIOS_CPU.jtag_debug_module_reset CH4_THRESH.reset reset
add_connection NIOS_CPU.jtag_debug_module_reset CH4_TIME.reset reset
add_connection NIOS_CPU.jtag_debug_module_reset CH4_TIMER_RST.reset reset
add_connection NIOS_CPU.jtag_debug_module_reset CH4_YN1_L.reset reset
add_connection NIOS_CPU.jtag_debug_module_reset CH4_YN1_ML.reset reset
add_connection NIOS_CPU.jtag_debug_module_reset CH4_YN1_MU.reset reset
add_connection NIOS_CPU.jtag_debug_module_reset CH4_YN1_U.reset reset
add_connection NIOS_CPU.jtag_debug_module_reset CH4_YN2_L.reset reset
add_connection NIOS_CPU.jtag_debug_module_reset CH4_YN2_ML.reset reset
add_connection NIOS_CPU.jtag_debug_module_reset CH4_YN2_MU.reset reset
add_connection NIOS_CPU.jtag_debug_module_reset CH4_YN2_U.reset reset
add_connection NIOS_CPU.jtag_debug_module_reset CH4_YN3_L.reset reset
add_connection NIOS_CPU.jtag_debug_module_reset CH4_YN3_ML.reset reset
add_connection NIOS_CPU.jtag_debug_module_reset CH4_YN3_MU.reset reset
add_connection NIOS_CPU.jtag_debug_module_reset CH4_YN3_U.reset reset
add_connection NIOS_CPU.jtag_debug_module_reset DETECTOR_ON.reset reset
add_connection NIOS_CPU.jtag_debug_module_reset FIFO_ADC_DATA.reset reset
add_connection NIOS_CPU.jtag_debug_module_reset FIFO_ADC_DATA_VALID.reset reset
add_connection NIOS_CPU.jtag_debug_module_reset FIFO_RST.reset reset
add_connection NIOS_CPU.jtag_debug_module_reset JTAG_UART.reset reset
add_connection NIOS_CPU.jtag_debug_module_reset LCD.reset reset
add_connection NIOS_CPU.jtag_debug_module_reset MENU.reset reset
add_connection NIOS_CPU.jtag_debug_module_reset MENU_DOWN.reset reset
add_connection NIOS_CPU.jtag_debug_module_reset MENU_UP.reset reset
add_connection NIOS_CPU.jtag_debug_module_reset RAM.reset1 reset
add_connection NIOS_CPU.jtag_debug_module_reset SSRAM.reset reset
add_connection NIOS_CPU.jtag_debug_module_reset SUBTRACTOR_ON.reset reset
add_connection NIOS_CPU.jtag_debug_module_reset tristate_bridge_ssram.reset reset
add_connection NIOS_CPU.jtag_debug_module_reset tristate_bridge_ssram_pinSharer.reset reset
add_connection NIOS_CPU.data_master ADC_ON.s1 avalon
set_connection_parameter_value NIOS_CPU.data_master/ADC_ON.s1 baseAddress 0x002035d0
add_connection NIOS_CPU.data_master CH0_PEAK_FOUND.s1 avalon
set_connection_parameter_value NIOS_CPU.data_master/CH0_PEAK_FOUND.s1 baseAddress 0x00203510
add_connection NIOS_CPU.data_master CH0_RD_PEAK.s1 avalon
set_connection_parameter_value NIOS_CPU.data_master/CH0_RD_PEAK.s1 baseAddress 0x00203520
add_connection NIOS_CPU.data_master CH0_THRESH.s1 avalon
set_connection_parameter_value NIOS_CPU.data_master/CH0_THRESH.s1 baseAddress 0x00203530
add_connection NIOS_CPU.data_master CH0_TIME.s1 avalon
set_connection_parameter_value NIOS_CPU.data_master/CH0_TIME.s1 baseAddress 0x002034c0
add_connection NIOS_CPU.data_master CH0_TIMER_RST.s1 avalon
set_connection_parameter_value NIOS_CPU.data_master/CH0_TIMER_RST.s1 baseAddress 0x00203580
add_connection NIOS_CPU.data_master CH0_YN1_L.s1 avalon
set_connection_parameter_value NIOS_CPU.data_master/CH0_YN1_L.s1 baseAddress 0x00203500
add_connection NIOS_CPU.data_master CH0_YN1_ML.s1 avalon
set_connection_parameter_value NIOS_CPU.data_master/CH0_YN1_ML.s1 baseAddress 0x002034f0
add_connection NIOS_CPU.data_master CH0_YN1_MU.s1 avalon
set_connection_parameter_value NIOS_CPU.data_master/CH0_YN1_MU.s1 baseAddress 0x002034e0
add_connection NIOS_CPU.data_master CH0_YN1_U.s1 avalon
set_connection_parameter_value NIOS_CPU.data_master/CH0_YN1_U.s1 baseAddress 0x002034d0
add_connection NIOS_CPU.data_master CH0_YN2_L.s1 avalon
set_connection_parameter_value NIOS_CPU.data_master/CH0_YN2_L.s1 baseAddress 0x00203480
add_connection NIOS_CPU.data_master CH0_YN2_ML.s1 avalon
set_connection_parameter_value NIOS_CPU.data_master/CH0_YN2_ML.s1 baseAddress 0x002034a0
add_connection NIOS_CPU.data_master CH0_YN2_MU.s1 avalon
set_connection_parameter_value NIOS_CPU.data_master/CH0_YN2_MU.s1 baseAddress 0x002034b0
add_connection NIOS_CPU.data_master CH0_YN2_U.s1 avalon
set_connection_parameter_value NIOS_CPU.data_master/CH0_YN2_U.s1 baseAddress 0x00203490
add_connection NIOS_CPU.data_master CH0_YN3_L.s1 avalon
set_connection_parameter_value NIOS_CPU.data_master/CH0_YN3_L.s1 baseAddress 0x00203470
add_connection NIOS_CPU.data_master CH0_YN3_ML.s1 avalon
set_connection_parameter_value NIOS_CPU.data_master/CH0_YN3_ML.s1 baseAddress 0x00203460
add_connection NIOS_CPU.data_master CH0_YN3_MU.s1 avalon
set_connection_parameter_value NIOS_CPU.data_master/CH0_YN3_MU.s1 baseAddress 0x00203450
add_connection NIOS_CPU.data_master CH0_YN3_U.s1 avalon
set_connection_parameter_value NIOS_CPU.data_master/CH0_YN3_U.s1 baseAddress 0x00203440
add_connection NIOS_CPU.data_master CH1_PEAK_FOUND.s1 avalon
set_connection_parameter_value NIOS_CPU.data_master/CH1_PEAK_FOUND.s1 baseAddress 0x00203400
add_connection NIOS_CPU.data_master CH1_RD_PEAK.s1 avalon
set_connection_parameter_value NIOS_CPU.data_master/CH1_RD_PEAK.s1 baseAddress 0x00203410
add_connection NIOS_CPU.data_master CH1_THRESH.s1 avalon
set_connection_parameter_value NIOS_CPU.data_master/CH1_THRESH.s1 baseAddress 0x00203420
add_connection NIOS_CPU.data_master CH1_TIME.s1 avalon
set_connection_parameter_value NIOS_CPU.data_master/CH1_TIME.s1 baseAddress 0x002033f0
add_connection NIOS_CPU.data_master CH1_TIMER_RST.s1 avalon
set_connection_parameter_value NIOS_CPU.data_master/CH1_TIMER_RST.s1 baseAddress 0x00203430
add_connection NIOS_CPU.data_master CH1_YN1_L.s1 avalon
set_connection_parameter_value NIOS_CPU.data_master/CH1_YN1_L.s1 baseAddress 0x002033b0
add_connection NIOS_CPU.data_master CH1_YN1_ML.s1 avalon
set_connection_parameter_value NIOS_CPU.data_master/CH1_YN1_ML.s1 baseAddress 0x002033c0
add_connection NIOS_CPU.data_master CH1_YN1_MU.s1 avalon
set_connection_parameter_value NIOS_CPU.data_master/CH1_YN1_MU.s1 baseAddress 0x002033d0
add_connection NIOS_CPU.data_master CH1_YN1_U.s1 avalon
set_connection_parameter_value NIOS_CPU.data_master/CH1_YN1_U.s1 baseAddress 0x002033e0
add_connection NIOS_CPU.data_master CH1_YN2_L.s1 avalon
set_connection_parameter_value NIOS_CPU.data_master/CH1_YN2_L.s1 baseAddress 0x00203370
add_connection NIOS_CPU.data_master CH1_YN2_ML.s1 avalon
set_connection_parameter_value NIOS_CPU.data_master/CH1_YN2_ML.s1 baseAddress 0x00203380
add_connection NIOS_CPU.data_master CH1_YN2_MU.s1 avalon
set_connection_parameter_value NIOS_CPU.data_master/CH1_YN2_MU.s1 baseAddress 0x00203390
add_connection NIOS_CPU.data_master CH1_YN2_U.s1 avalon
set_connection_parameter_value NIOS_CPU.data_master/CH1_YN2_U.s1 baseAddress 0x002033a0
add_connection NIOS_CPU.data_master CH1_YN3_L.s1 avalon
set_connection_parameter_value NIOS_CPU.data_master/CH1_YN3_L.s1 baseAddress 0x00203330
add_connection NIOS_CPU.data_master CH1_YN3_ML.s1 avalon
set_connection_parameter_value NIOS_CPU.data_master/CH1_YN3_ML.s1 baseAddress 0x00203340
add_connection NIOS_CPU.data_master CH1_YN3_MU.s1 avalon
set_connection_parameter_value NIOS_CPU.data_master/CH1_YN3_MU.s1 baseAddress 0x00203350
add_connection NIOS_CPU.data_master CH1_YN3_U.s1 avalon
set_connection_parameter_value NIOS_CPU.data_master/CH1_YN3_U.s1 baseAddress 0x00203360
add_connection NIOS_CPU.data_master CH2_PEAK_FOUND.s1 avalon
set_connection_parameter_value NIOS_CPU.data_master/CH2_PEAK_FOUND.s1 baseAddress 0x002032f0
add_connection NIOS_CPU.data_master CH2_RD_PEAK.s1 avalon
set_connection_parameter_value NIOS_CPU.data_master/CH2_RD_PEAK.s1 baseAddress 0x00203300
add_connection NIOS_CPU.data_master CH2_THRESH.s1 avalon
set_connection_parameter_value NIOS_CPU.data_master/CH2_THRESH.s1 baseAddress 0x00203310
add_connection NIOS_CPU.data_master CH2_TIME.s1 avalon
set_connection_parameter_value NIOS_CPU.data_master/CH2_TIME.s1 baseAddress 0x002032e0
add_connection NIOS_CPU.data_master CH2_TIMER_RST.s1 avalon
set_connection_parameter_value NIOS_CPU.data_master/CH2_TIMER_RST.s1 baseAddress 0x00203320
add_connection NIOS_CPU.data_master CH2_YN1_L.s1 avalon
set_connection_parameter_value NIOS_CPU.data_master/CH2_YN1_L.s1 baseAddress 0x002032a0
add_connection NIOS_CPU.data_master CH2_YN1_ML.s1 avalon
set_connection_parameter_value NIOS_CPU.data_master/CH2_YN1_ML.s1 baseAddress 0x002032b0
add_connection NIOS_CPU.data_master CH2_YN1_MU.s1 avalon
set_connection_parameter_value NIOS_CPU.data_master/CH2_YN1_MU.s1 baseAddress 0x002032c0
add_connection NIOS_CPU.data_master CH2_YN1_U.s1 avalon
set_connection_parameter_value NIOS_CPU.data_master/CH2_YN1_U.s1 baseAddress 0x002032d0
add_connection NIOS_CPU.data_master CH2_YN2_L.s1 avalon
set_connection_parameter_value NIOS_CPU.data_master/CH2_YN2_L.s1 baseAddress 0x00203260
add_connection NIOS_CPU.data_master CH2_YN2_ML.s1 avalon
set_connection_parameter_value NIOS_CPU.data_master/CH2_YN2_ML.s1 baseAddress 0x00203270
add_connection NIOS_CPU.data_master CH2_YN2_MU.s1 avalon
set_connection_parameter_value NIOS_CPU.data_master/CH2_YN2_MU.s1 baseAddress 0x00203280
add_connection NIOS_CPU.data_master CH2_YN2_U.s1 avalon
set_connection_parameter_value NIOS_CPU.data_master/CH2_YN2_U.s1 baseAddress 0x00203290
add_connection NIOS_CPU.data_master CH2_YN3_L.s1 avalon
set_connection_parameter_value NIOS_CPU.data_master/CH2_YN3_L.s1 baseAddress 0x00203220
add_connection NIOS_CPU.data_master CH2_YN3_ML.s1 avalon
set_connection_parameter_value NIOS_CPU.data_master/CH2_YN3_ML.s1 baseAddress 0x00203230
add_connection NIOS_CPU.data_master CH2_YN3_MU.s1 avalon
set_connection_parameter_value NIOS_CPU.data_master/CH2_YN3_MU.s1 baseAddress 0x00203240
add_connection NIOS_CPU.data_master CH2_YN3_U.s1 avalon
set_connection_parameter_value NIOS_CPU.data_master/CH2_YN3_U.s1 baseAddress 0x00203250
add_connection NIOS_CPU.data_master CH3_PEAK_FOUND.s1 avalon
set_connection_parameter_value NIOS_CPU.data_master/CH3_PEAK_FOUND.s1 baseAddress 0x002031e0
add_connection NIOS_CPU.data_master CH3_RD_PEAK.s1 avalon
set_connection_parameter_value NIOS_CPU.data_master/CH3_RD_PEAK.s1 baseAddress 0x002031f0
add_connection NIOS_CPU.data_master CH3_THRESH.s1 avalon
set_connection_parameter_value NIOS_CPU.data_master/CH3_THRESH.s1 baseAddress 0x00203200
add_connection NIOS_CPU.data_master CH3_TIME.s1 avalon
set_connection_parameter_value NIOS_CPU.data_master/CH3_TIME.s1 baseAddress 0x002031c0
add_connection NIOS_CPU.data_master CH3_TIMER_RST.s1 avalon
set_connection_parameter_value NIOS_CPU.data_master/CH3_TIMER_RST.s1 baseAddress 0x00203210
add_connection NIOS_CPU.data_master CH3_YN1_L.s1 avalon
set_connection_parameter_value NIOS_CPU.data_master/CH3_YN1_L.s1 baseAddress 0x00203130
add_connection NIOS_CPU.data_master CH3_YN1_ML.s1 avalon
set_connection_parameter_value NIOS_CPU.data_master/CH3_YN1_ML.s1 baseAddress 0x00203110
add_connection NIOS_CPU.data_master CH3_YN1_MU.s1 avalon
set_connection_parameter_value NIOS_CPU.data_master/CH3_YN1_MU.s1 baseAddress 0x00203120
add_connection NIOS_CPU.data_master CH3_YN1_U.s1 avalon
set_connection_parameter_value NIOS_CPU.data_master/CH3_YN1_U.s1 baseAddress 0x002031d0
add_connection NIOS_CPU.data_master CH3_YN2_L.s1 avalon
set_connection_parameter_value NIOS_CPU.data_master/CH3_YN2_L.s1 baseAddress 0x00203170
add_connection NIOS_CPU.data_master CH3_YN2_ML.s1 avalon
set_connection_parameter_value NIOS_CPU.data_master/CH3_YN2_ML.s1 baseAddress 0x00203160
add_connection NIOS_CPU.data_master CH3_YN2_MU.s1 avalon
set_connection_parameter_value NIOS_CPU.data_master/CH3_YN2_MU.s1 baseAddress 0x00203150
